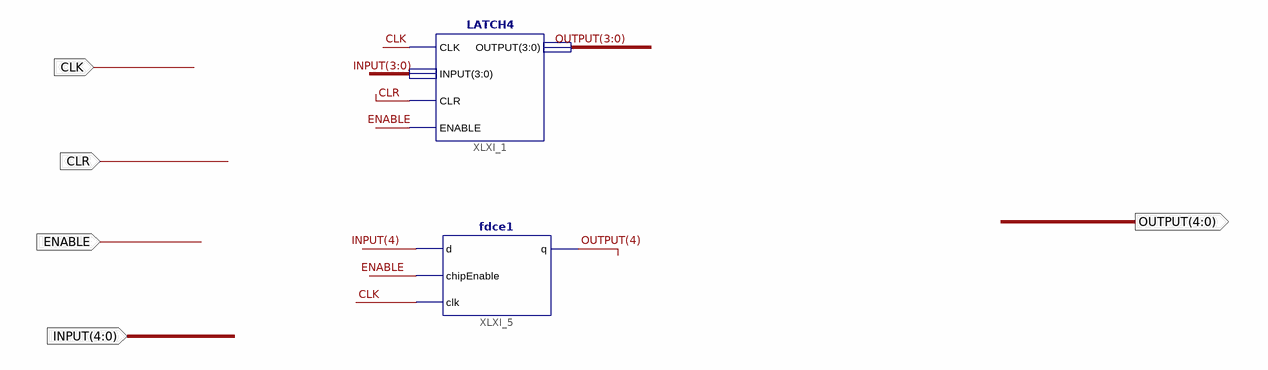
[diagram p0: schematic sheet 1]
// Xilinx ISE schematic LATCH5.sch (artix7) as structural Verilog: 2 symbols, 5 ports
module LATCH5 (
  input  CLK,
  input  CLR,
  input  ENABLE,
  input  [4:0] INPUT,
  output [4:0] OUTPUT
);

  LATCH4 XLXI_1 (.CLK(CLK), .INPUT(INPUT[3:0]), .CLR(CLR), .ENABLE(ENABLE), .OUTPUT(OUTPUT[3:0]));
  fdce1 XLXI_5 (.clk(CLK), .chipEnable(ENABLE), .d(INPUT[4]), .q(OUTPUT[4]));
endmodule
